# Altium schematic sheet MCU_CAN.SchDoc
size B; SheetNumber: 5; SheetTotal: 5
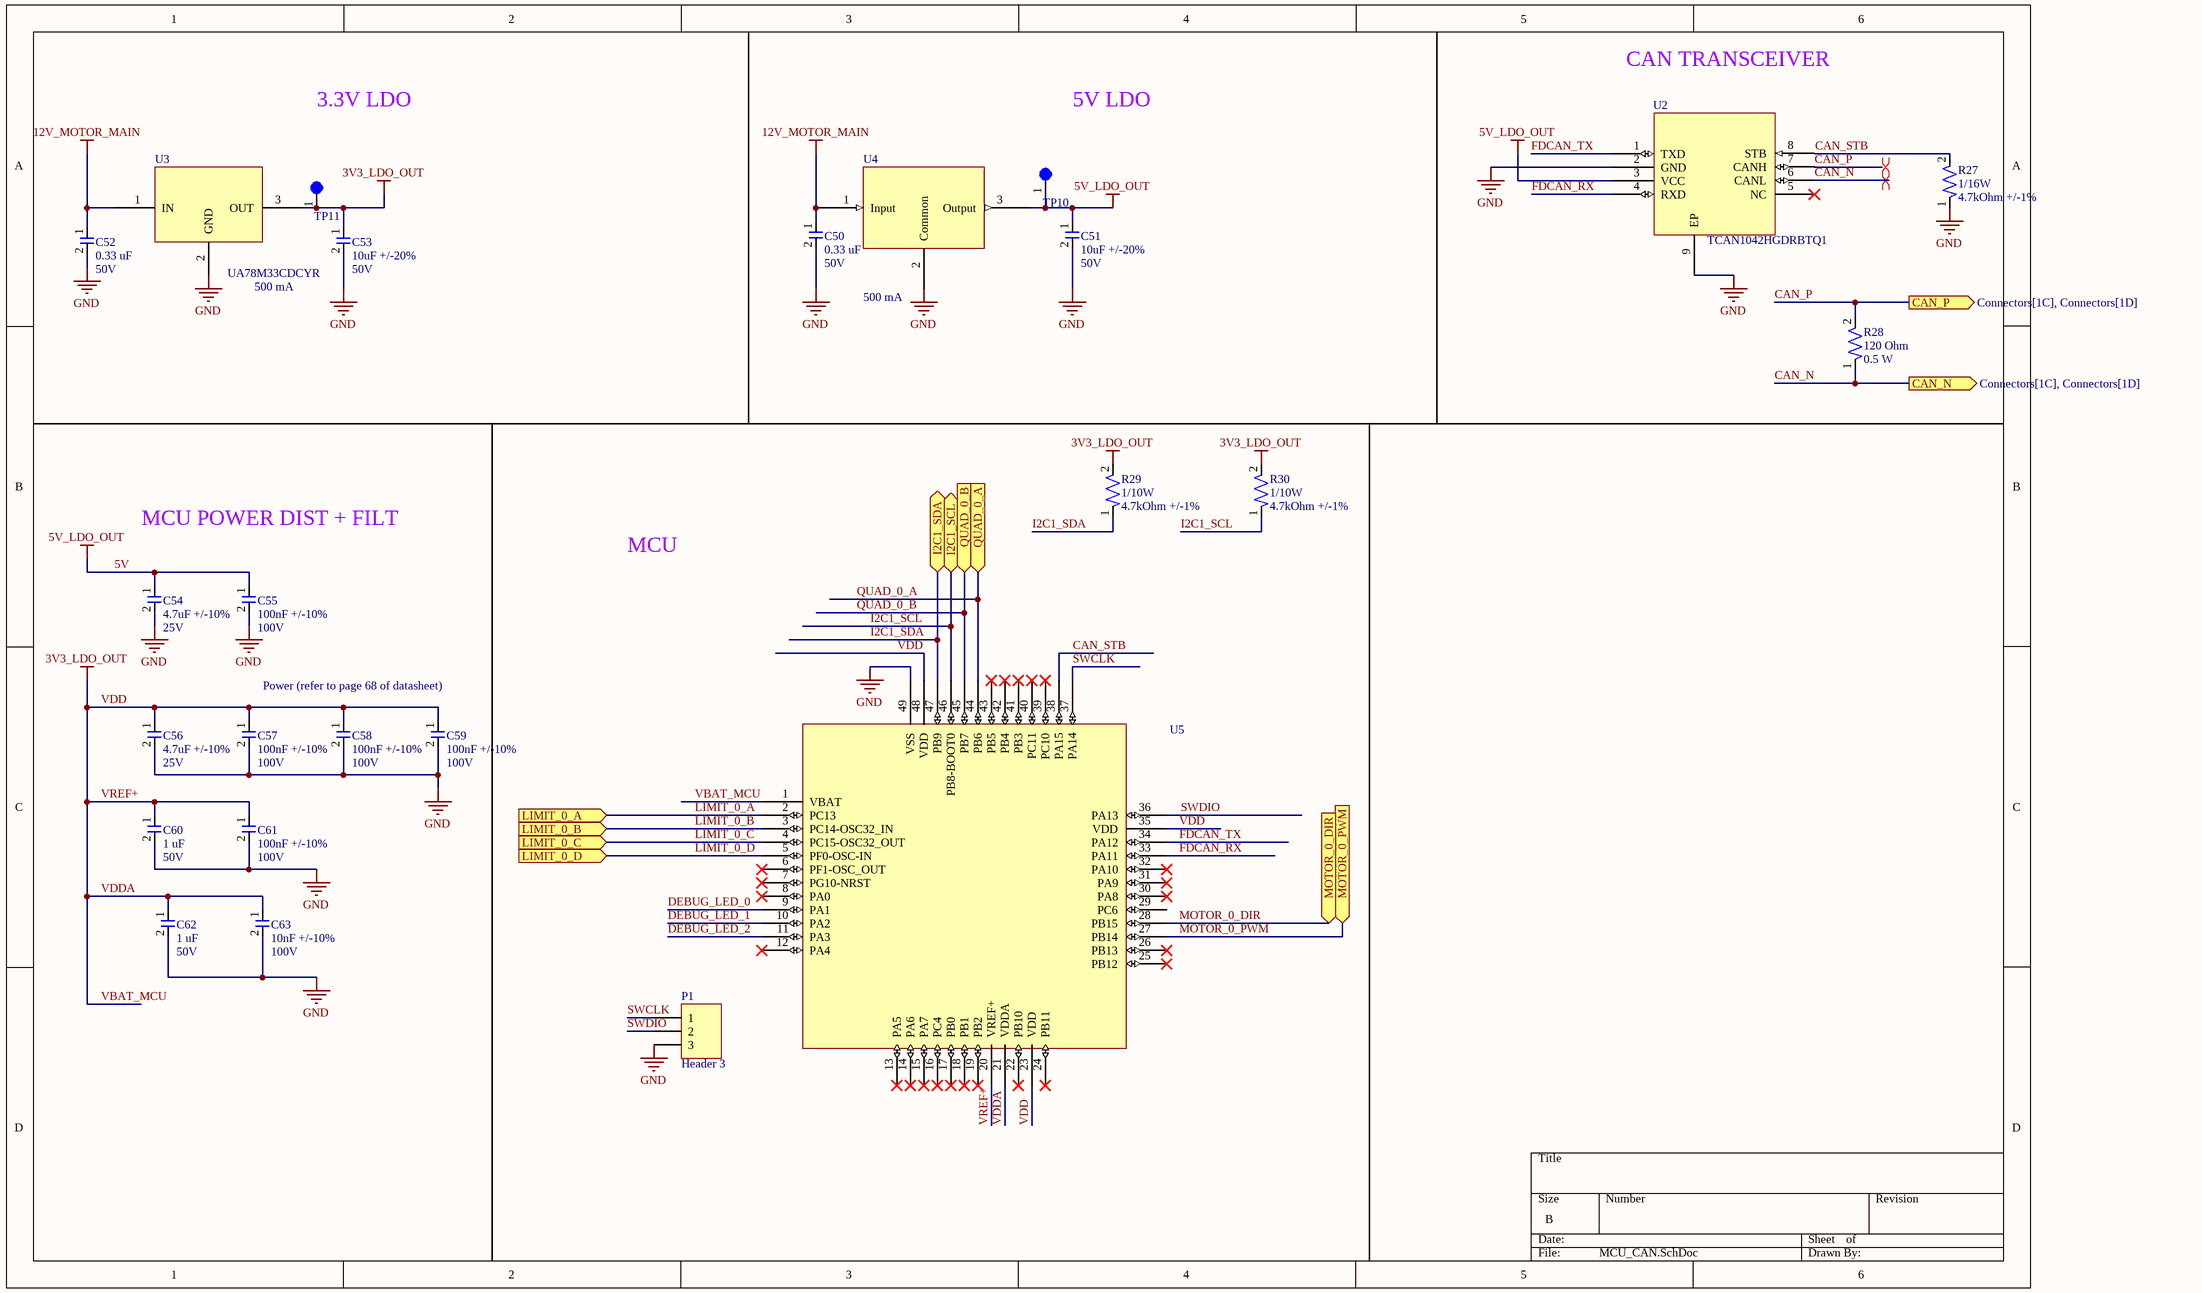
[diagram p0: MCU_CAN.SchDoc]

## Parts
C50  Capacitance: 0.33 uF  Voltage: 50V  [CAP-0603]  (hidden comment: CGA3E3X7R1H334K080AB)
C51  Capacitance: 10uF +/-20%  Voltage Rating: 50V  [CAP-1206]  (hidden comment: CL31B106KBHNNNE)
C52  Capacitance: 0.33 uF  Voltage: 50V  [CAP-0603]  (hidden comment: CGA3E3X7R1H334K080AB)
C53  Capacitance: 10uF +/-20%  Voltage Rating: 50V  [CAP-1206]  (hidden comment: CL31B106KBHNNNE)
C54  Capacitance: 4.7uF +/-10%  Voltage Rating: 25V  [CAP-0603]  (hidden comment: TMK107BBJ475KA-T)
C55  Capacitance: 100nF +/-10%  Voltage Rating: 100V  [CAP-0603]  (hidden comment: CC0603KRX7R0BB104)
C56  Capacitance: 4.7uF +/-10%  Voltage Rating: 25V  [CAP-0603]  (hidden comment: TMK107BBJ475KA-T)
C57  Capacitance: 100nF +/-10%  Voltage Rating: 100V  [CAP-0603]  (hidden comment: CC0603KRX7R0BB104)
C58  Capacitance: 100nF +/-10%  Voltage Rating: 100V  [CAP-0603]  (hidden comment: CC0603KRX7R0BB104)
C59  Capacitance: 100nF +/-10%  Voltage Rating: 100V  [CAP-0603]  (hidden comment: CC0603KRX7R0BB104)
C60  Capacitance: 1 uF  Voltage: 50V  [CAP-0603]  (hidden comment: UMK107AB7105KA-T)
C61  Capacitance: 100nF +/-10%  Voltage Rating: 100V  [CAP-0603]  (hidden comment: CC0603KRX7R0BB104)
C62  Capacitance: 1 uF  Voltage: 50V  [CAP-0603]  (hidden comment: UMK107AB7105KA-T)
C63  Capacitance: 10nF +/-10%  Voltage Rating: 100V  [CAP-0402]  (hidden comment: CC0402KRX7R0BB103)
P1  Header 3  [HDR1X3]
R27  Power Rating: 1/16W  Resistance: 4.7kOhm +/-1%  [RES-0402]  (hidden comment: RC0402FR-074K7P)
R28  Resistance: 120 Ohm  Power: 0.5 W  [RES-1206]  (hidden comment: CRGH1206F120R)
R29  Power Rating: 1/10W  Resistance: 4.7kOhm +/-1%  [RES-0603]  (hidden comment: AF0603FR-074K7L)
R30  Power Rating: 1/10W  Resistance: 4.7kOhm +/-1%  [RES-0603]  (hidden comment: AF0603FR-074K7L)
TP10  5003  [TEST-POINT-0001]  (value not drawn)
TP11  5003  [TEST-POINT-0001]  (value not drawn)
U2  TCAN1042HGDRBTQ1  [IC-8-VSON]
U3  UA78M33CDCYR  Current: 500 mA  [IC-SOT-223-4]
U4  Current: 500 mA  [IC-SOT-223-4]  (hidden comment: UA78M05IDCYR)
U5  STM32G431CBU6  [MCU-UFQFPN48]  (value not drawn)

## Ports
CAN_N (out, see Connectors[1C], Connectors[1D]), CAN_P (out, see Connectors[1C], Connectors[1D]), I2C1_SCL (bidir, see Connectors[2C]), I2C1_SDA (bidir, see Connectors[2B]), LIMIT_0_A (in, see Connectors[2D]), LIMIT_0_B (in, see Connectors[2D]), LIMIT_0_C (in, see Connectors[2D]), LIMIT_0_D (in, see Connectors[2D]), MOTOR_0_DIR (in, see HBridge_Top_Level[4B], HBridge_Top_Level[4C]), MOTOR_0_PWM (in, see HBridge_Top_Level[2A], HBridge_Top_Level[2C]), QUAD_0_A (in, see Connectors[2B]), QUAD_0_B (in, see Connectors[2B])

## Nets
5V: C51.1 C54.1 C55.1 TP10.1 U2.3(VCC) U4.3(Output)  [also labelled 5V_LDO_OUT]
12V_MOTOR_MAIN: C50.1 C52.1 U3.1(IN) U4.1(Input)
GND: C50.2 C51.2 C52.2 C53.2 C54.2 C55.2 C56.2 C57.2 C58.2 C59.2 C60.2 C61.2 C62.2 C63.2 P1.3 R27.1 U2.2(GND) U2.9(EP) U3.2(GND) U4.2(Common) U5.49(VSS)
VBAT_MCU: C53.1 C56.1 C57.1 C58.1 C59.1 C60.1 C61.1 C62.1 C63.1 R29.2 R30.2 TP11.1 U3.3(OUT) U5.1(VBAT) U5.20(VREF+) U5.21(VDDA) U5.23(VDD) U5.35(VDD) U5.48(VDD)  [also labelled 3V3_LDO_OUT, VDD, VDDA, VREF+]
CAN_N: R28.1 U2.6(CANL) ; port CAN_N
CAN_P: R28.2 U2.7(CANH) ; port CAN_P
CAN_STB: R27.2 U2.8(STB) U5.38(PA15)
DEBUG_LED_0: U5.9(PA1)
DEBUG_LED_1: U5.10(PA2)
DEBUG_LED_2: U5.11(PA3)
FDCAN_RX: U2.4(RXD) U5.33(PA11)
FDCAN_TX: U2.1(TXD) U5.34(PA12)
I2C1_SCL: R30.1 U5.46(PB8-BOOT0) ; port I2C1_SCL
I2C1_SDA: R29.1 U5.47(PB9) ; port I2C1_SDA
LIMIT_0_A: U5.2(PC13) ; port LIMIT_0_A
LIMIT_0_B: U5.3(PC14-OSC32_IN) ; port LIMIT_0_B
LIMIT_0_C: U5.4(PC15-OSC32_OUT) ; port LIMIT_0_C
LIMIT_0_D: U5.5(PF0-OSC-IN) ; port LIMIT_0_D
MOTOR_0_DIR: U5.28(PB15) ; port MOTOR_0_DIR
MOTOR_0_PWM: U5.27(PB14) ; port MOTOR_0_PWM
QUAD_0_A: U5.44(PB6) ; port QUAD_0_A
QUAD_0_B: U5.45(PB7) ; port QUAD_0_B
SWCLK: P1.1 U5.37(PA14)
SWDIO: P1.2 U5.36(PA13)

Not connected (* = marked no-connect by the designer): U2 5(NC)*; U5 6(PF1-OSC_OUT)* 7(PG10-NRST)* 8(PA0)* 12(PA4)* 13(PA5)* 14(PA6)* 15(PA7)* 16(PC4)* 17(PB0)* 18(PB1)* 19(PB2)* 22(PB10)* 24(PB11)* 25(PB12)* 26(PB13)* 29(PC6) 30(PA8)* 31(PA9)* 32(PA10)* 39(PC10)* 40(PC11)* 41(PB3)* 42(PB4)* 43(PB5)*

## Layout directives
differential pair: CAN_N, CAN_P

## Notes on the sheet
- CAN TRANSCEIVER
- 3.3V LDO
- 5V LDO
- MCU POWER DIST + FILT
- MCU
- Power (refer to page 68 of datasheet)

## Library data of the parts
C50 C52 = CAP-0.33uF-0001: 0.33 µF ±10% 50V Ceramic Capacitor X7R 0603 (1608 Metric); Manufacturer: TDK Corporation; Tolerance: +/- 10%; Manufacturer Part Number: CGA3E3X7R1H334K080AB; Temperature Coefficient: X7R
C51 C53 = CAP-10U-0001: 10 µF ±10% 50V Ceramic Capacitor X7R 1206 (3216 Metric); Manufacturer: Samsung Electro-Mechanics; Assembled?: no; Manufacturer Part Number: CL31B106KBHNNNE; Temperature Coefficient: X7R; Package Size: 1206
C54 C56 = CAP-4.7U-0001: 4.7 µF ±10% 25V Ceramic Capacitor X5R 0603 (1608 Metric); Manufacturer: Taiyo Yuden; Assembled?: no; Manufacturer Part Number: TMK107BBJ475KA-T; Temperature Coefficient: X5R; Package Size: 0603
C55 C57-C59 C61 = CAP-100N-0001: CAP CER 0.1UF 100V X7R 0603; Manufacturer: YAGEO; Assembled?: no; Manufacturer Part Number: CC0603KRX7R0BB104; Temperature Coefficient: X7R; Package Size: 0603
C60 C62 = CAP-1U-0002: 1 µF ±10% 50V Ceramic Capacitor X7R 0603 (1608 Metric); Package Size: 0603
C63 = CAP-10N-0001: 10000 pF ±10% 100V Ceramic Capacitor X7R 0402 (1005 Metric); Manufacturer: YAGEO; Assembled?: no; Manufacturer Part Number: CC0402KRX7R0BB103; Temperature Coefficient: X7R; Package Size: 0402
P1 = Header 3: Header, 3-Pin; LatestRevisionDate: 17-Jul-2002; LatestRevisionNote: Re-released for DXP Platform.; Publisher: Altium Limited
R27 = RES-4.7K-0001: RES SMD 4.7K OHM 1% 1/16W 0402; Manufacturer: YAGEO; Assembled?: no; Manufacturer Part Number: RC0402FR-074K7P; Package Size: 0402
R28 = RES-120-0002: 120 Ohms ±1% 0.5W, 1/2W Chip Resistor 1206 (3216 Metric) Thick Film; Tolerance: 1%; Package Size: 1206
R29 R30 = RES-4.7K-0002: RES SMD 4.7K OHM 1% 1/10W 0603; Manufacturer: YAGEO; Assembled?: no; Manufacturer Part Number: AF0603FR-074K7L; Package Size: 0603
TP10 TP11 = TEST-POINT-0001: Oranange PC Test Point, Miniature Phoisphor Bronze Silver Plating Through Hole Mounting Type
U2 = IC-CAN-TRANSCEIVER-0002: 1/1 Transceiver CANbus 8-VSON (3x3); Manufacturer: Texas Instrument; CAN Capability: FD-CAN; Manufacturer Part Number: TCAN1042HGDRBTQ1
U3 = IC-LDO-3.3V-0002: Linear Voltage Regulator IC Positive Fixed 1 Output 500mA SOT-223-4; Vin: 25V; Vout: 3.3V; Package: SOT-223-4
U4 = IC-LDO-5V-0003: Linear Voltage Regulator IC Positive Fixed 1 Output 500mA SOT-223-4; Manufacturer: Texas Instruments; Assembled?: no; Manufacturer Part Number: UA78M05IDCYR; Package Size: SOT223-4; Type: Low dropout (LDO)
U5 = IC-STM32G431CBU6: 128KB 1.71V~3.6V ARM-MSeries 32KB 170MHz FLASH 42 UFQFPN-48(7x7) Microcontroller Units (MCUs/MPUs/SOCs) ROHS; Assembled?: no; Manufacturer Part Number: STM32G431CBU6; Package: UFQFPN-48